# EAGLE design psvsd-v20 (EAGLE 8.2.0)

## Sheet 1 of 2: SD/USB
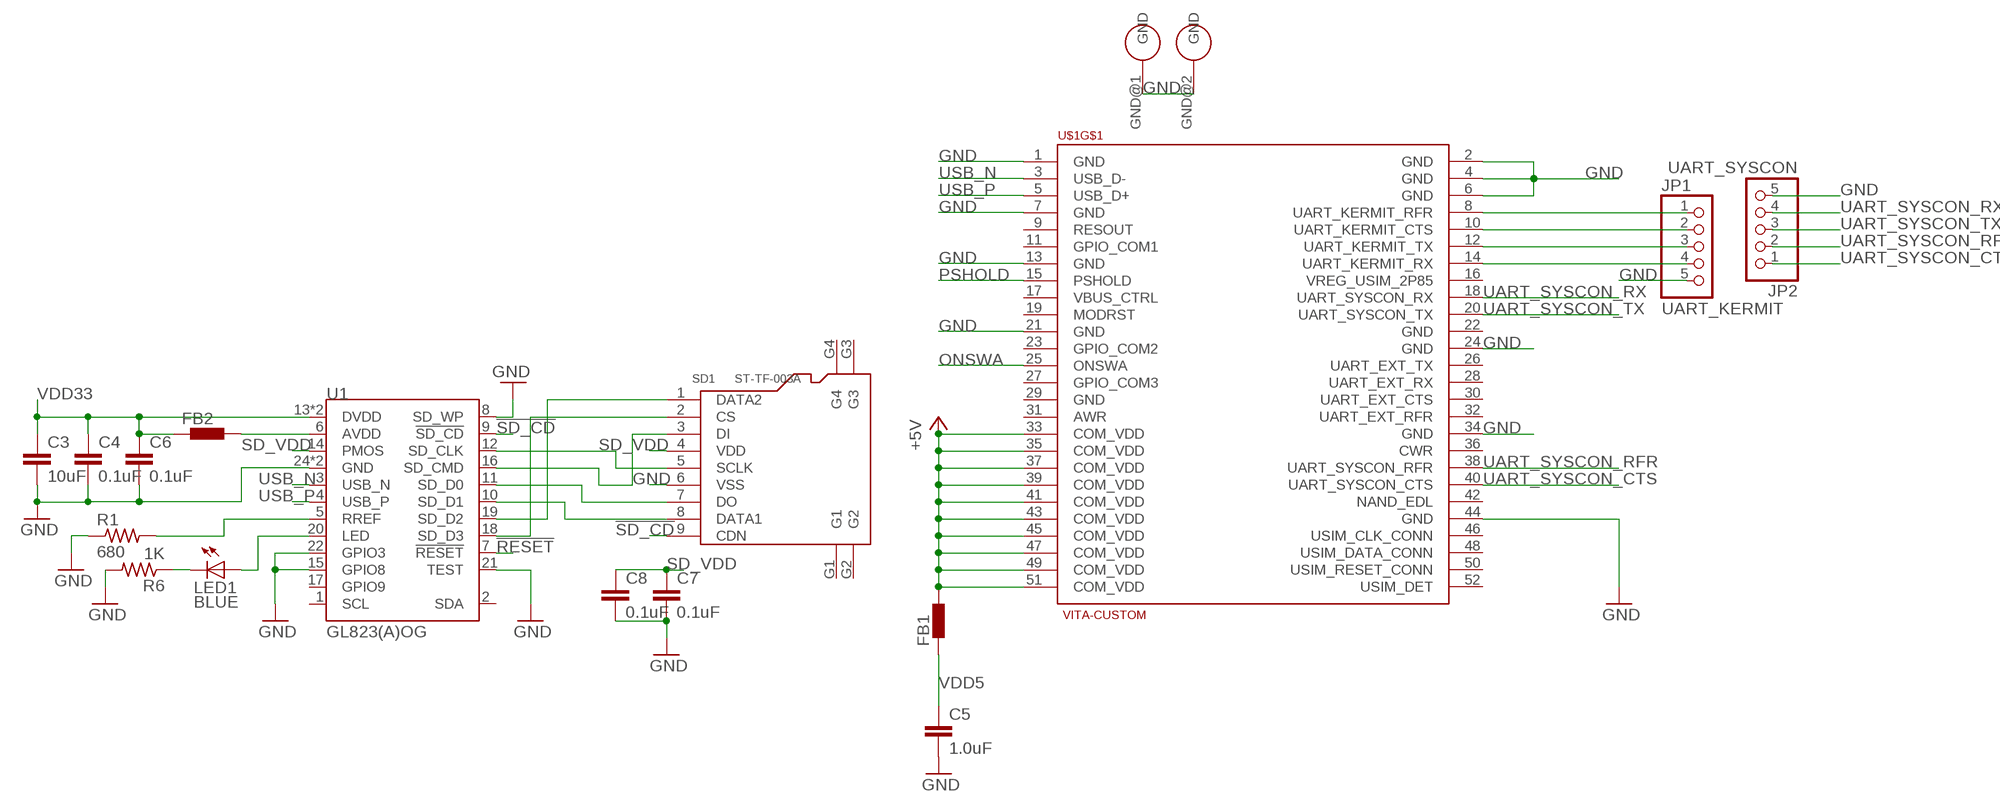
[diagram p0: schematic, sheet 1]

### Parts
C3  10uF  C-EUC0402  [C0402]
C4  0.1uF  C-EUC0402  [C0402]
C5  1.0uF  C-EUC0603  [C0603]
C6  0.1uF  C-EUC0402  [C0402]
C7  0.1uF  C-EUC0402  [C0402]
C8  0.1uF  C-EUC0402  [C0402]
FB1  BLM15HB121SN1  [0402]
FB2  BLM15HB121SN1  [0402]
JP1  UART_KERMIT  PINHD-1X5  [1X05]
JP2  UART_SYSCON  PINHD-1X5  [1X05]
LED1  BLUE  LEDSML0603  [SML0603]
R1  680  R-US_R0603  [R0603]
R6  1K  R-US_R0603  [R0603]
SD1  ST-TF-003A  MICRO-SD-CARD-SOCKET-9P(ST-TF-003A)  [MICRO-SD9+4P-SMD-16.1X14.5X1.85MM]
U1  GL823(A)OG  [QFN-24]
U$1  VITA-CUSTOM  [VITA-MINI-PCI-E]

### Nets
!RESET: U1.7(!RESET) ; also sheet 2
!SD_CD: SD1.9(CDN) U1.9(!SD_CD)
+5V: FB1.2 U$1.33(COM_VDD) U$1.35(COM_VDD) U$1.37(COM_VDD) U$1.39(COM_VDD) U$1.41(COM_VDD) U$1.43(COM_VDD) U$1.45(COM_VDD) U$1.47(COM_VDD) U$1.49(COM_VDD) U$1.51(COM_VDD)
AVDD: FB2.2 U1.6(AVDD)
GND [GND]: C3.2 C4.2 C5.2 C6.2 C7.2 C8.2 JP1.5 JP2.5 R1.1 R6.2 SD1.6(VSS) U1.8(SD_WP) U1.15(GPIO8) U1.21(TEST) U1.22(GPIO3) U1.24(GND) U1.25(GND) U$1.1(GND) U$1.2(GND) U$1.4(GND) U$1.6(GND) U$1.7(GND) U$1.13(GND) U$1.21(GND) U$1.24(GND) U$1.34(GND) U$1.44(GND) U$1.GND@1(GND) U$1.GND@2(GND) ; also sheet 2
LED: LED1.A U1.20(LED)
LED_N: LED1.C R6.1
ONSWA: U$1.25(ONSWA) ; also sheet 2
PSHOLD: U$1.15(PSHOLD) ; also sheet 2
RREF: R1.2 U1.5(RREF)
SD_CLK [Clock/HS]: SD1.5(SCLK) U1.12(SD_CLK)
SD_CMD: SD1.3(DI) U1.16(SD_CMD)
SD_D0 [Clock/HS]: SD1.7(DO) U1.11(SD_D0)
SD_D1 [GND]: SD1.8(DATA1) U1.10(SD_D1)
SD_D2 [Clock/HS]: SD1.1(DATA2) U1.19(SD_D2)
SD_D3 [Clock/HS]: SD1.2(CS) U1.18(SD_D3)
SD_VDD: C7.1 C8.1 SD1.4(VDD) U1.14(PMOS)
UART_KERMIT_CTS: JP1.2 U$1.10(UART_KERMIT_CTS)
UART_KERMIT_RFR: JP1.1 U$1.8(UART_KERMIT_RFR)
UART_KERMIT_RX: JP1.4 U$1.14(UART_KERMIT_RX)
UART_KERMIT_TX: JP1.3 U$1.12(UART_KERMIT_TX)
UART_SYSCON_CTS: JP2.1 U$1.40(UART_SYSCON_CTS)
UART_SYSCON_RFR: JP2.2 U$1.38(UART_SYSCON_RFR)
UART_SYSCON_RX: JP2.4 U$1.18(UART_SYSCON_RX)
UART_SYSCON_TX: JP2.3 U$1.20(UART_SYSCON_TX)
USB_N [USB]: U1.3(USB_N) U$1.3(USB_D-)
USB_P [USB]: U1.4(USB_P) U$1.5(USB_D+)
VDD5: C5.1 FB1.1 ; also sheet 2
VDD33: C3.1 C4.1 C6.1 FB2.1 U1.13(DVDD) U1.23(DVDD) ; also sheet 2
Unconnected: SD1.G1 SD1.G2 SD1.G3 SD1.G4 U1.1(SCL) U1.2(SDA) U1.17(GPIO9) U$1.9(RESOUT) U$1.11(GPIO_COM1) U$1.16(VREG_USIM_2P85) U$1.17(VBUS_CTRL) U$1.19(MODRST) U$1.22(GND) U$1.23(GPIO_COM2) U$1.26(UART_EXT_TX) U$1.27(GPIO_COM3) U$1.28(UART_EXT_RX) U$1.29(GND) U$1.30(UART_EXT_CTS) U$1.31(AWR) U$1.32(UART_EXT_RFR) U$1.36(CWR) U$1.42(NAND_EDL) U$1.46(USIM_CLK_CONN) U$1.48(USIM_DATA_CONN) U$1.50(USIM_RESET_CONN) U$1.52(USIM_DET)

## Sheet 2 of 2: Power Management
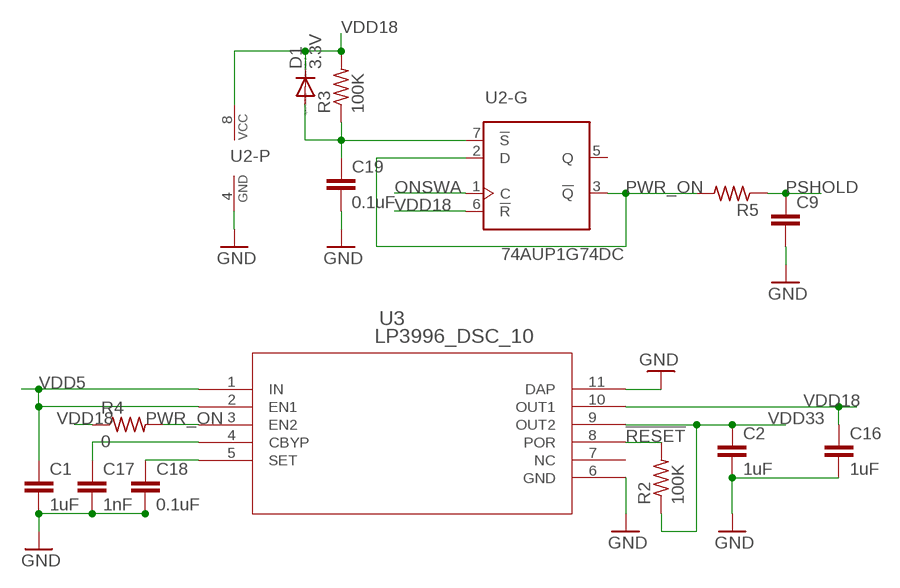
[diagram p1: schematic, sheet 2]

### Parts
C1  1uF  C-EUC0603  [C0603]
C2  1uF  C-EUC0603  [C0603]
C9  C-EUC0402  [C0402]
C16  1uF  C-EUC0603  [C0603]
C17  1nF  C-EUC0402  [C0402]
C18  0.1uF  C-EUC0402  [C0402]
C19  0.1uF  C-EUC0402  [C0402]
D1  3.3V  DIODE-SOD523  [SOD523]
R2  100K  R-US_R0603  [R0603]
R3  100K  R-US_R0603  [R0603]
R4  0  R-US_R0402  [R0402]
R5  R-US_R0603  [R0603]
U2  74AUP1G74DC  [SOT765]
U3  LP3996_DSC_10  [SDA10A]

### Nets
!RESET: R2.2 U3.8(POR) ; also sheet 1
!S: C19.1 D1.A R3.1 U2.7(-G:!S)
CBYP: C17.1 U3.4(CBYP)
CSET: C18.1 U3.5(SET)
GND [GND]: C1.2 C2.2 C9.2 C16.2 C17.2 C18.2 C19.2 U2.4(-P:GND) U3.6(GND) U3.11(DAP) ; also sheet 1
ONSWA: U2.1(-G:C) ; also sheet 1
PSHOLD: C9.1 R5.1 ; also sheet 1
PWR_ON: R4.2 R5.2 U2.2(-G:D) U2.3(-G:!Q) U3.3(EN2)
VDD5: C1.1 U3.1(IN) U3.2(EN1) ; also sheet 1
VDD18: C16.1 D1.C R3.2 R4.1 U2.6(-G:!R) U2.8(-P:VCC) U3.10(OUT1)
VDD33: C2.1 R2.1 U3.9(OUT2) ; also sheet 1
Unconnected: U2.5(-G:Q) U3.7(NC)

## Library data of the parts
C1-C9 C16 C17 C19 = rcl:C-EU: CAPACITOR, European symbol
C18 = resistor:C-EU: CAPACITOR, European symbol
D1 = diode:DIODE-: DIODE
FB1 FB2 = inductors:BLM15H: EMIFIL (R) Chip Ferrite Bead for GHz Noise Source: http://www.murata.com/ Ferrite Bead BLM15H.pdf
JP1 JP2 = pinhead:PINHD-1X5: PIN HEADER
LED1 = led:LED: LED OSRAM: - CHIPLED LG R971, LG N971, LY N971, LG Q971, LY Q971, LO R971, LY R971 LH N974, LH R974 LS Q976, LO Q976, LY Q976 LO Q996 - Hyper CHIPLED LW Q18S LB Q993, LB Q99A, LB R99A - SideLED LS A670, LO A670, LY A670, LG A670, LP A670 LB A673, LV A673, LT A673, LW A673 LH A674 LY A675 LS A676, LA A676, LO A676, LY A676, LW A676 LS A679, LY A679, LG A679 - Hyper Micro SIDELED® LS Y876, LA Y876, LO Y876, LY Y876 LT Y87S - SmartLED LW L88C, LW L88S LB L89C, LB L89S, LG L890 LS L89K, LO L89K, LY L89K LS L896, LA L896, LO L896, LY L896 - TOPLED LS T670, LO T670, LY T670, LG T670, LP T670 LSG T670, LSP T670, LSY T670, LOP T670, LYG T670 LG T671, LOG T671, LSG T671 LB T673, LV T673, LT T673, LW T673 LH T674 LS T676, LA T676, LO T676, LY T676, LB T676, LH T676, LSB T676, LW T676 LB T67C, LV T67C, LT T67C, LS T67K, LO T67K, LY T67K, LW E67C LS E67B, LA E67B, LO E67B, LY E67B, LB E67C, LV E67C, LT E67C LW T67C LS T679, LY T679, LG T679 LS T770, LO T770, LY T770, LG T770, LP T770 LB T773, LV T773, LT T773, LW T773 LH T774 LS E675, LA E675, LY E675, LS T675 LS T776, LA T776, LO T776, LY T776, LB T776 LHGB T686 LT T68C, LB T68C - Hyper Mini TOPLED® LB M676 - Mini TOPLED Santana® LG M470 LS M47K, LO M47K, LY M47K Source: http://www.osram.convergy.de LUXEON: - LUMILED® LXK2-PW12-R00, LXK2-PW12-S00, LXK2-PW14-U00, LXK2-PW14-V00 LXK2-PM12-R00, LXK2-PM12-S00, LXK2-PM14-U00 LXK2-PE12-Q00, LXK2-PE12-R00, LXK2-PE12-S00, LXK2-PE14-T00, LXK2-PE14-U00 LXK2-PB12-K00, LXK2-PB12-L00, LXK2-PB12-M00, LXK2-PB14-N00, LXK2-PB14-P00, LXK2-PB14-Q00 LXK2-PR12-L00, LXK2-PR12-M00, LXK2-PR14-Q00, LXK2-PR14-R00 LXK2-PD12-Q00, LXK2-PD12-R00, LXK2-PD12-S00 LXK2-PH12-R00, LXK2-PH12-S00 LXK2-PL12-P00, LXK2-PL12-Q00, LXK2-PL12-R00 Source: www.luxeon.com KINGBRIGHT: KA-3528ASYC Source: www.kingbright.com
R1-R6 = rcl:R-US_: RESISTOR, American symbol
SD1 = Seeed-Connector:MICRO-SD-CARD-SOCKET-9P(ST-TF-003A): 320090000; MPN: ST-TF-003A
U1 = GL823:GL823(A): USB 2.0 SD/MMC Card Reader Controller (3.3V)
U2 = NXP_60_26022015:74AUP1G74: Low-power D-type flip-flop with set and reset; positive-edge trigger The 74AUP1G74 provides a low-power, low-voltage single positive-edge triggered D-type flip-flop with individual data (D), clock (CP), set (SD) and reset (RD) inputs and complementary Q and Q outputs. The SD and RD are asynchronous active LOW inputs and operate independently of the clock input. Information on the data input is transferred to the Q output on the LOW-to-HIGH transition of the clock pulse. The D input must be stable one set-up time prior to the LOW-to-HIGH clock transition for predictable operation. Schmitt trigger action at all inputs makes the circuit tolerant to slower input rise and fall times across the entire VCC range from 0.8 V to 3.6 V. This device ensures a very low static and dynamic power consumption across the entire VCC range from 0.8 V to 3.6 V. This device is fully specified for partial power-down applications using IOFF. The IOFF circuitry disables the output, preventing the damaging backflow current through the device when it is powered down. AAL Eindhoven MK
U3 = LP3996:LP3996_DSC_10; BASE_PN: LP3996; COMP: TypeLDO; LIBRARY: ReferenceLP3996SD; PARTNUMBER: LP3996SD0833; PIN: Count10; SYMBOL: NameLP3996SD0833; TYPE: LP3996SD0833; VENDOR: NationalSemiconductor; VERSION: 1
U$1 = mini-pci-e:VITA-CUSTOM: Vita specific half Mini PCI Express module.

## Net classes
2 Clock/HS: clearance 1.27 mm to class 1
3 GND: clearance 0.508 mm to class 1

## Board
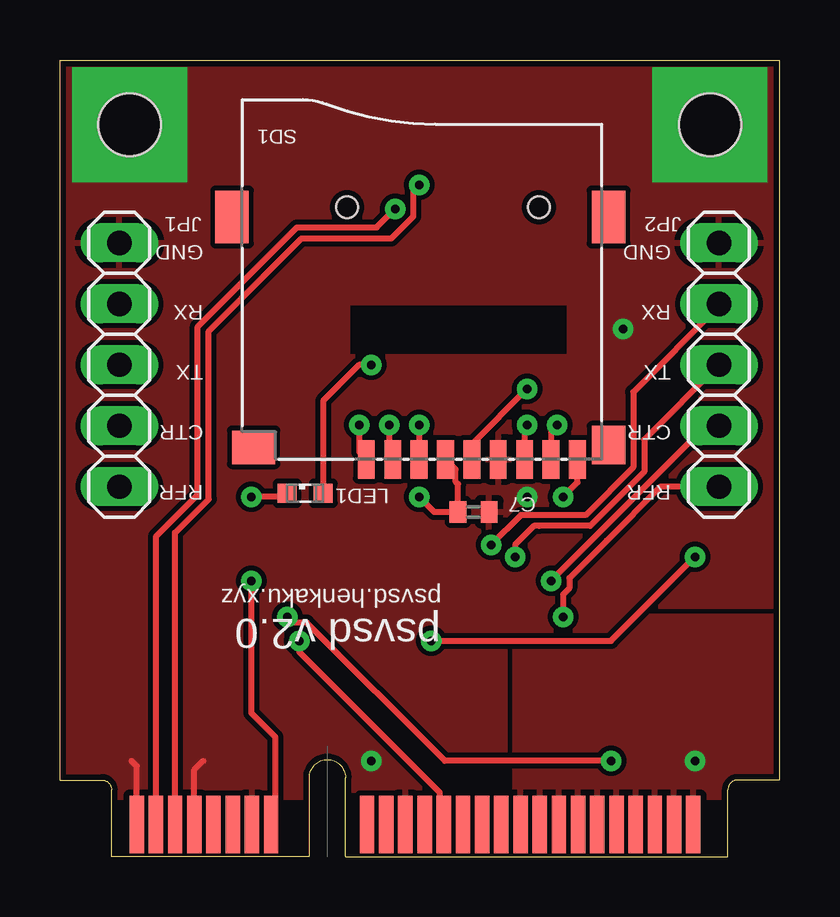
[diagram p2: board, top side]
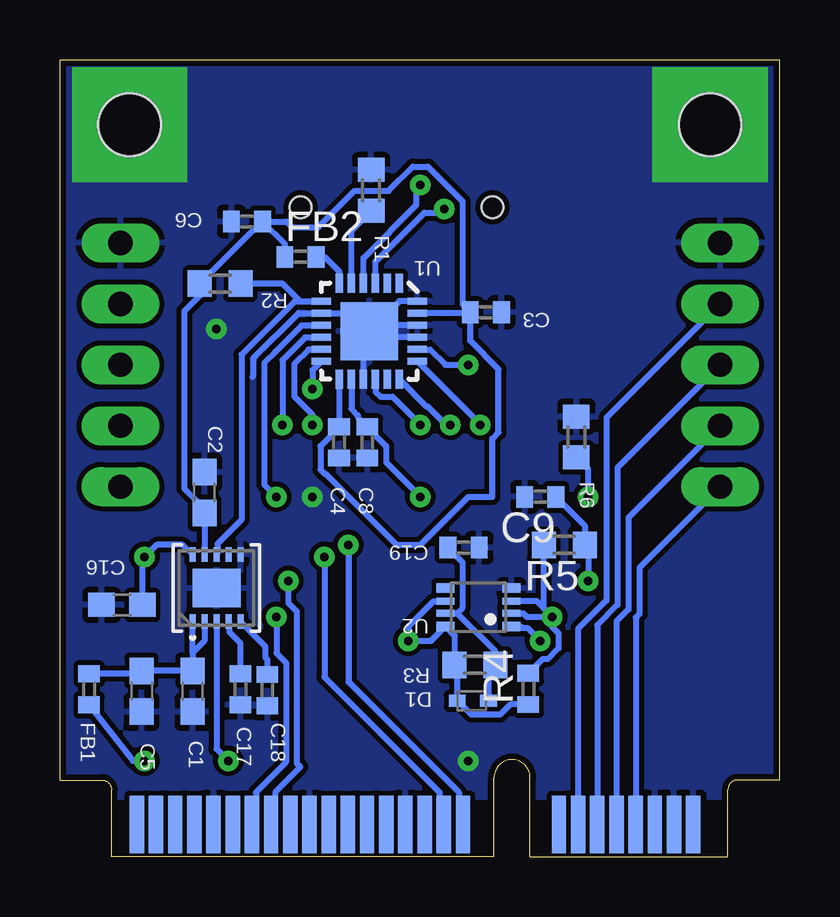
[diagram p3: board, bottom side, seen from below]

Size 30 x 33.2 mm. Coordinates in mm from the lower left corner, seen from the top.
Copper layers (1*16): Top 0.035mm / dielectric 1.5mm / Bottom 0.035mm
Design rules "SparkFun *": minimum track width 10mil, minimum drill 0.3mm, track to track 8mil, track to pad 8mil, pad to pad 8mil, via to via 8mil, smd to smd 8mil, copper to edge 10mil, drill to drill 8mil, minimum pad ring 12mil, minimum via ring 10mil, stop-mask expansion 4mil, vias tented up to drill 25mil, thermal gap 10mil

### Footprints (pad centres in the part's own frame; a part is rotated, then mirrored left to right if it is on the bottom)
C0603 = smd 1.1 x 1: 1 -0.85,0; 2 0.85,0
C0402 = smd 0.7 x 0.9: 1 -0.65,0; 2 0.65,0
SOD523 = smd 0.7 x 0.5: A 0.7,0; C -0.6,0
0402 = smd 0.7 x 0.9: 1 -0.65,0; 2 0.65,0
1X05 = drill 1.016 long: 1 -5.08,0; 2 -2.54,0; 3 0,0; 4 2.54,0; 5 5.08,0
SML0603 = smd 0.8 x 0.8: A 0.75,0; C -0.75,0
R0603 = smd 1 x 1.1: 1 -0.85,0; 2 0.85,0
R0402 = smd 0.7 x 0.9: 1 -0.65,0; 2 0.65,0
MICRO-SD9+4P-SMD-16.1X14.5X1.85MM = smd 1.6 x 0.7: 1 0,2.25; 2 0,1.15; 3 0,0.05; 4 0,-1.05; 5 0,-2.15; 6 0,-3.25; 7 0,-4.35; 8 0,-5.45; 9 0,-6.55 | smd 1.6 x 1.4: G1 0.6,-7.85 | smd 2.2 x 1.4: G2 10.1,-7.85; G3 10.1,7.85 | smd 1.4 x 1.8: G4 0.5,6.95 | hole 0.9: 10.5,-4.95; 10.5,3.05
QFN-24 = smd 0.8 x 0.3: 1 -2,1.25; 2 -2,0.75; 3 -2,0.25; 4 -2,-0.25; 5 -2,-0.75; 6 -2,-1.25; 13 2,-1.25; 14 2,-0.75; 15 2,-0.25; 16 2,0.25; 17 2,0.75; 18 2,1.25 | smd 0.3 x 0.8: 7 -1.25,-2; 8 -0.75,-2; 9 -0.25,-2; 10 0.25,-2; 11 0.75,-2; 12 1.25,-2; 19 1.25,2; 20 0.75,2; 21 0.25,2; 22 -0.25,2; 23 -0.75,2; 24 -1.25,2 | smd 2.4 x 2.4: 25 0,0
SOT765 = smd 0.4 x 0.75: 1 -0.8,-1.375; 4 0.8,-1.375; 5 0.8,1.375; 8 -0.8,1.375 | smd 0.3 x 0.75: 2 -0.25,-1.375; 3 0.25,-1.375; 6 0.25,1.375; 7 -0.25,1.375
SDA10A = smd 0.61 x 0.254: 1 -1.397,1; 2 -1.397,0.5; 3 -1.397,0; 4 -1.397,-0.5; 5 -1.397,-1; 6 1.397,-1; 7 1.397,-0.5; 8 1.397,0; 9 1.397,0.5; 10 1.397,1 | smd 1.6 x 2.007: 11 0,0
VITA-MINI-PCI-E = smd 0.6 x 2.4: 1 -7.95,1.35; 3 -7.15,1.35; 5 -6.35,1.35; 7 -5.55,1.35; 9 -4.75,1.35; 11 -3.95,1.35; 13 -3.15,1.35; 15 -2.35,1.35; 17 1.65,1.35; 19 2.45,1.35; 21 3.25,1.35; 23 4.05,1.35; 25 4.85,1.35; 27 5.65,1.35; 29 6.45,1.35; 31 7.25,1.35; 33 8.05,1.35; 35 8.85,1.35; 37 9.65,1.35; 39 10.45,1.35; 41 11.25,1.35; 43 12.05,1.35; 45 12.85,1.35; 47 13.65,1.35; 49 14.45,1.35; 51 15.25,1.35 | smd 0.6 x 2.4 bottom: 2 -7.55,1.35; 4 -6.75,1.35; 6 -5.95,1.35; 8 -5.15,1.35; 10 -4.35,1.35; 12 -3.55,1.35; 14 -2.75,1.35; 16 -1.95,1.35; 18 2.05,1.35; 20 2.85,1.35; 22 3.65,1.35; 24 4.45,1.35; 26 5.25,1.35; 28 6.05,1.35; 30 6.85,1.35; 32 7.65,1.35; 34 8.45,1.35; 36 9.25,1.35; 38 10.05,1.35; 40 10.85,1.35; 42 11.65,1.35; 44 12.45,1.35; 46 13.25,1.35; 48 14.05,1.35; 50 14.85,1.35; 52 15.65,1.35 | drill 2.6 pad 4.8 square: GND@1 -8.25,30.5; GND@2 15.95,30.5 | hole 2.6: -8.25,30.5; 15.95,30.5

### Placement (x,y rotation side)
C1  24.47,6.9 270 bottom
C2  23.97,15.18 90 bottom
C3  12.24,22.69 0 bottom
C4  18.36,17.27 270 bottom
C5  26.59,6.9 270 bottom
C6  22.2,26.47 180 bottom
C7  17.24,14.37 0 top
C8  17.18,17.27 270 bottom
C9  9.97,15 180 bottom
C16  27.41,10.5 180 bottom
C17  22.47,6.98 270 bottom
C18  21.35,6.95 270 bottom
C19  13.17,12.88 0 bottom
D1  12.83,6.5 0 bottom
FB1  28.78,6.98 270 bottom
FB2  19.97,25 0 bottom
JP1  2.47,20.5 90 top
JP2  27.47,20.5 90 top
LED1  10.22,15.15 0 top
R1  17.02,27.77 270 bottom
R2  23.32,23.88 0 bottom
R3  12.69,8 180 bottom
R4  10.47,7 90 bottom
R5  8.97,13 180 bottom
R6  8.47,17.49 90 bottom
SD1  15.02,16.56 90 top
U1  17.1,21.9 270 bottom
U2  12.55,10.4 90 bottom
U3  23.47,11.2 90 bottom
U$1  11.15,0 0 top

### Tracks (layer width: path | path; a pad name or v marks a point on that pad's centre or on a via)
!RESET
  Bottom 0.254: U3.8 23.43,12.64 23.43,13.04 22.43,14.04 22.43,20.93 20.23,23.13 19.97,23.13 | U1.7 19.12,23.13 19.97,23.13 | 19.97,23.13 20.72,23.88 R2.2
!S
  Bottom 0.254: U2.7 13.91,10.13 13.42,10.13 | 13.42,10.13 11.84,8.56 R3.1 12.13,7.71 D1.A | 13.42,10.13 13.42,10.17 13.22,10.36 13.22,12.28 C19.1
!SD_CD  (via drill 0.35)
  Top 0.254: v20.97,15 21.57,15.6 SD1.9
  Bottom 0.254: U1.9 19.12,22.13 19.93,22.13 21.02,21.05 21.48,20.58 21.48,15.51 v20.97,15
+5V  (via drill 0.35)
  Bottom 0.254: v26.47,4 26.95,4 FB1.2
  pour Top: 18.97,2.5 29.97,2.5 29.97,10 18.97,10
AVDD
  Bottom 0.254: U1.6 18.35,24.38 18.97,25 FB2.2
CBYP
  Bottom 0.254: U3.4 22.93,9.76 22.93,9.36 22.47,8.9 C17.1
CSET
  Bottom 0.254: C18.1 21.35,8.22 21.43,8.3 21.43,8.76 U3.5
GND  (via drill 0.35)
  Top 0.254: U$1.1 3.2,3.77 2.97,4 | U$1.7 5.6,3.63 5.97,4
  Bottom 0.254: 21.97,20 21.94,20.03 21.94,20.77 20.06,22.65 U1.8 17.85,22.65 U1.25 | U1.24 15.85,23.15 U1.25 | U1.15 17.35,21.65 U1.25 | U1.21 16.85,21.65 U1.25 | U1.22 16.85,22.15 U1.25
  other vias: 19.47,15 12.97,4 23.47,22
  pour Top (rank 2): -0.03,2.5 29.97,2.5 29.97,33.5 -0.03,33.5
  pour Bottom: -0.03,2.5 -0.03,33.5 29.97,33.5 29.97,2.5
LED  (via drill 0.35)
  Top 0.254: LED1.A 10.97,19 12.47,20.5 v12.97,20.5
  Bottom 0.254: 15.08,21.13 U1.20 15.08,21.13 | 15.08,21.13 14.57,21.13 13.94,20.5 v12.97,20.5
LED_N  (via drill 0.35)
  Top 0.254: LED1.C 9.32,15 v7.97,15
  Bottom 0.254: v7.97,15 7.97,16.14 R6.1
ONSWA  (via drill 0.35)
  Top 0.254: U$1.25 15.83,1.52 15.83,2.69 9.97,8.54 v9.97,9
  Bottom 0.254: U2.1 10.78,9.6 10.73,9.54 10.52,9.54 v9.97,9
PSHOLD  (via drill 0.35)
  Top 0.254: 8.63,1.52 U$1.15 8.97,1.52 8.97,5 7.97,6 v7.97,11.5
  Bottom 0.254: C9.1 8.12,13.8 R5.1 7.97,12.85 v7.97,11.5
PWR_ON  (via drill 0.35)
  Top 0.254: v22.97,4 16.05,4 10.29,9.76 9.71,9.76 v9.47,10
  Bottom 0.254: U3.3 23.47,4.5 v22.97,4 | v9.47,10 10.54,10 10.67,10.13 11.16,10.13 U2.2 | v9.47,10 10.12,10.65 U2.3 | v9.47,10 9.82,10.35 R5.2 | v9.47,10 9.47,9.57 9.21,9.31 9.21,8.69 9.66,8.24 9.88,8.24 R4.2
RREF
  Bottom 0.254: U1.5 17.85,26.09 R1.2
SD_CLK  (via drill 0.35)
  Top 0.254: v19.47,19.5 17.17,17.2 SD1.5
  Bottom 0.254: U1.12 19.47,20.28 v19.47,19.5
SD_CMD  (via drill 0.35)
  Top 0.254: v14.97,18 SD1.3
  Bottom 0.254: U1.16 16.83,19.88 16.83,19.36 16.64,19.17 16.14,19.17 v14.97,18
SD_D0  (via drill 0.35)
  Top 0.254: v19.47,18 19.37,17.9 SD1.7
  Bottom 0.254: U1.11 19.12,21.13 19.64,21.13 20.23,20.54 20.23,19.19 19.47,18.43 v19.47,18
SD_D1  (via drill 0.35)
  Top 0.254: v20.72,18 20.47,17.75 SD1.8
  Bottom 0.254: U1.10 19.12,21.63 19.79,21.63 20.72,20.69 v20.72,18
SD_D2  (via drill 0.35)
  Top 0.254: v12.47,18 12.47,16.86 SD1.1
  Bottom 0.254: U1.19 12.47,18.02 v12.47,18
SD_D3  (via drill 0.35)
  Top 0.254: v13.72,18 13.72,16.71 SD1.2
  Bottom 0.254: U1.18 14.71,18.76 14.66,18.76 13.9,18 v13.72,18
SD_VDD  (via drill 0.35)
  Top 0.254: v14.97,15 15.6,14.37 C7.1 16.59,15.52 16.49,15.62 16.49,16.14 SD1.4
  Bottom 0.254: U1.14 17.85,18.68 17.58,18.41 17.58,18.32 C8.1 17.18,17.89 16.4,17.11 16.4,16.43 v14.97,15
UART_KERMIT_CTS
  Bottom 0.254: JP1.2 6.3,14.13 6.3,10.31 6.8,9.81 U$1.10
UART_KERMIT_RFR
  Bottom 0.254: JP1.1 5.84,12.05 5.84,10.12 6,9.96 U$1.8
UART_KERMIT_RX
  Bottom 0.254: U$1.14 8.4,9.5 7.21,10.69 7.21,18.3 JP1.4
UART_KERMIT_TX
  Bottom 0.254: JP1.3 6.76,16.22 6.76,10.5 7.6,9.65 U$1.12
UART_SYSCON_CTS  (via drill 0.35)
  Top 0.254: JP2.1 25.04,15.42 22.8,13.18 | 22.8,13.18 22.49,12.87 | 22.8,13.18 21.23,11.61 21.23,11.19 20.97,10.93 v20.97,10
  Bottom 0.254: U$1.40 21.83,1.52 21.83,2.69 20.57,3.94 20.57,8.09 20.97,8.49 v20.97,10
UART_SYSCON_RFR  (via drill 0.35)
  Top 0.254: JP2.2 26.93,17.96 22.3,13.33 v20.47,11.5
  Bottom 0.254: U$1.38 21.03,1.52 21.03,2.69 19.97,3.74 20.12,3.89 20.12,10.22 20.47,10.57 v20.47,11.5
UART_SYSCON_RX  (via drill 0.35)
  Top 0.254: JP2.4 27.47,22.93 23.9,19.36 23.9,16.22 21.92,14.24 19.21,14.24 v17.97,13
  Bottom 0.254: U$1.18 13.37,1.52 13.37,2.69 17.97,7.29 v17.97,13
UART_SYSCON_TX  (via drill 0.35)
  Top 0.254: 19.97,13.78 22.11,13.78 24.36,16.03 24.36,17.39 JP2.3 | 19.97,13.78 19.76,13.78 | 19.97,13.78 19.76,13.78 | 19.76,13.78 18.97,13 v18.97,12.5
  Bottom 0.254: U$1.20 14.17,1.52 14.17,2.69 18.97,7.49 v18.97,12.5
USB_N  (via drill 0.35)
  Top 0.254: U$1.3 4,13.35 5.75,15.1 5.75,22.09 9.88,26.23 13.2,26.23 v13.97,27
  Bottom 0.254: U1.3 16.85,24.8 14.81,26.84 14.14,26.84 v13.97,27
USB_P  (via drill 0.35)
  Top 0.254: U$1.5 4.8,13.5 6.2,14.9 6.2,21.91 10.07,25.77 13.82,25.77 14.73,26.69 14.73,27.76 v14.97,28
  Bottom 0.254: U1.4 17.35,24.94 15.14,27.16 15.14,27.84 v14.97,28
VDD5
  Bottom 0.254: 24.47,8.5 C1.1 C5.1 26.71,7.63 FB1.1 | 24.47,8.5 U3.1 | U3.2 23.97,9 24.47,8.5
VDD18  (via drill 0.35)
  Top 0.254: v15.47,9 22.97,9 v26.47,12.5
  Bottom 0.254: U2.8 13.54,9.21 R3.2 13.43,7.89 D1.C 12.85,5.92 11.65,5.92 11.22,6.35 R4.1 | U2.8 14,9.67 | U3.10 24.88,13 25.97,13 v26.47,12.5 26.56,12.41 C16.1 | U2.8 14.53,9 v15.47,9 15.47,9.6 14.44,10.63 13.95,10.63 U2.6
VDD33
  Bottom 0.254: U1.23 12.93,22.65 C3.1 | U3.9 C2.1 23.97,14.51 24.8,15.34 24.8,22.75 24.17,23.38 R2.1 21.58,26.47 C6.1 | U1.13 C4.1 18.36,17.89 19.14,17.11 19.14,16.13 18.95,15.94 18.91,15.94 15.97,13 14.97,13 12.97,15 11.97,15 11.97,17.43 11.71,17.69 11.71,20.31 12.89,21.49 C3.1 | FB2.1 20.62,25.54 C6.1 | C6.1 20.56,26.47 20.32,26.23 19.23,26.23 17.71,27.75 16.3,27.75 15.29,28.76 14.66,28.76 13.21,27.31 13.21,23.01 C3.1

### Text on the board
tPlace: GND | GND | RX | RX | TX | TX | CTR | CTR | RFR | RFR | psvsd.henkaku.xyz | psvsd v2.0